# Altium project Pedalboard.PrjPCB
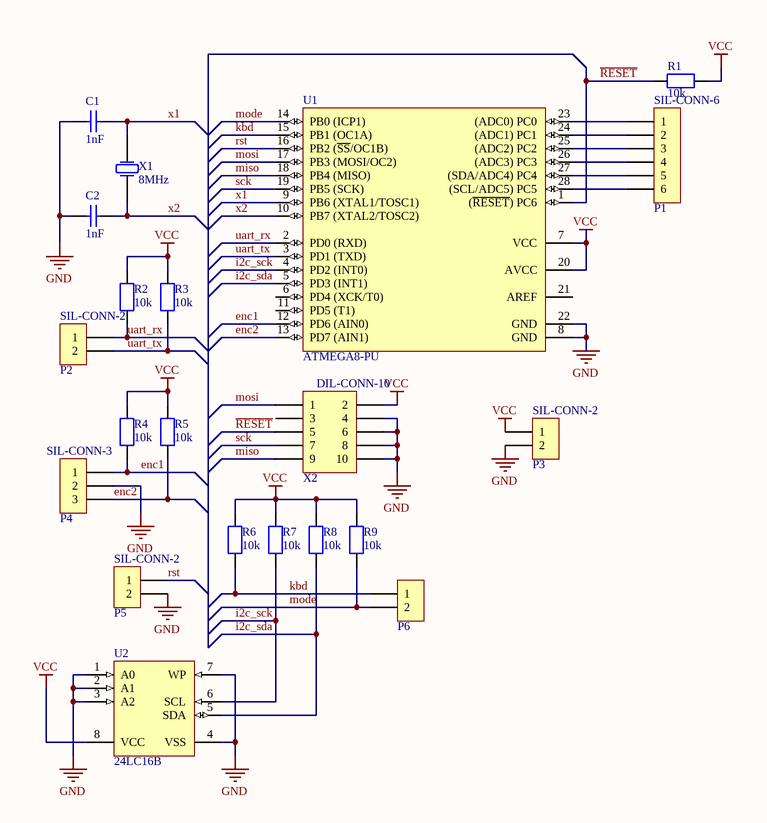
[diagram p0: AVR_MAIN.SchDoc]
5 sheets, 127 parts. Net scope: global (net labels, ports and power ports of the same name join across sheets).
Board files: AVR_MAIN.PcbDoc, AVR_KBD.PcbDoc, MOSFET_Switch_Serial.PcbDoc, MOSFET_Switch_Parallel.PcbDoc, 12-digit-display.PcbDoc
Sheets:
  AVR_MAIN.SchDoc
  AVR_KBD.SchDoc
  12-digit-display.SchDoc
  MOSFET_Switch_Serial.SchDoc
  MOSFET_Switch_Parallel.SchDoc

## Sheet AVR_MAIN.SchDoc
size A4

### Parts
C1  value 1nF  [0805_Capacitor]  (hidden comment: Capacitor)
C2  value 1nF  [0805_Capacitor]  (hidden comment: Capacitor)
P1  SIL-CONN-6  [SIL-CONN-6]
P2  SIL-CONN-2  [SIL-CONN-2]
P3  SIL-CONN-2  [SIL-CONN-2]
P4  SIL-CONN-3  [SIL-CONN-3]
P5  SIL-CONN-2  [SIL-CONN-2-jumper]
P6  SIL-CONN-2  [SIL-CONN-2]  (value not drawn)
R1  value 10k  [0805_Resistor]  (hidden comment: Resistor)
R2  value 10k  [0805_Resistor]  (hidden comment: Resistor)
R3  value 10k  [0805_Resistor]  (hidden comment: Resistor)
R4  value 10k  [0805_Resistor]  (hidden comment: Resistor)
R5  value 10k  [0805_Resistor]  (hidden comment: Resistor)
R6  value 10k  [0805_Resistor]  (hidden comment: Resistor)
R7  value 10k  [0805_Resistor]  (hidden comment: Resistor)
R8  value 10k  [0805_Resistor]  (hidden comment: Resistor)
R9  value 10k  [0805_Resistor]  (hidden comment: Resistor)
U1  ATMEGA8-PU  [DIP28_Narrow]
U2  24LC16B  [DIP8]
X1  Frequency: 8MHz  [HC49]  (hidden comment: Crystal)
X2  DIL-CONN-10  [DIL-CONN-IDC-10]

### Nets
GND: C1.1 C2.1 P3.2 P4.2 P5.2 U1.8(GND) U1.22(GND) U2.1(A0) U2.2(A1) U2.3(A2) U2.4(VSS) U2.7(WP) X2.4 X2.6 X2.8 X2.10  [project net ~{OE}]
VCC: P3.1 R1.2 R2.2 R3.2 R4.2 R5.2 R6.2 R7.2 R8.2 R9.2 U1.7(VCC) U1.20(AVCC) U2.8(VCC) X2.2
enc1: P4.1 R4.1 U1.12(PD6_(AIN0))
enc2: P4.3 R5.1 U1.13(PD7_(AIN1))
i2c_sck: R7.1 U1.4(PD2_(INT0)) U2.6(SCL)
i2c_sda: R8.1 U1.5(PD3_(INT1)) U2.5(SDA)
kbd: P6.1 R6.1 U1.15(PB1_(OC1A)) U1.18(PB4_(MISO)) X2.9  [also labelled miso]
mode: P6.2 R9.1 U1.14(PB0_(ICP1))
mosi: P2.2 R3.1 U1.3(PD1_(TXD)) U1.17(PB3_(MOSI/OC2)) X2.1  [also labelled uart_tx]
~{RESET}: R1.1 U1.1((~{RESET})_PC6) X2.5
rst: P5.1 U1.16(PB2_(~{SS}/OC1B))
sck: U1.19(PB5_(SCK)) X2.7
uart_rx: P2.1 R2.1 U1.2(PD0_(RXD))
x1: C1.2 U1.9(PB6_(XTAL1/TOSC1)) X1.2
x2: C2.2 U1.10(PB7_(XTAL2/TOSC2)) X1.1
NetP1_1: P1.1 U1.23((ADC0)_PC0)
NetP1_2: P1.2 U1.24((ADC1)_PC1)
NetP1_3: P1.3 U1.25((ADC2)_PC2)
NetP1_4: P1.4 U1.26((ADC3)_PC3)
NetP1_5: P1.5 U1.27((SDA/ADC4)_PC4)
NetP1_6: P1.6 U1.28((SCL/ADC5)_PC5)

Not connected (* = marked no-connect by the designer): U1 6(PD4_(XCK/T0)) 11(PD5_(T1)) 21(AREF); X2 3

## Sheet AVR_KBD.SchDoc
size A4
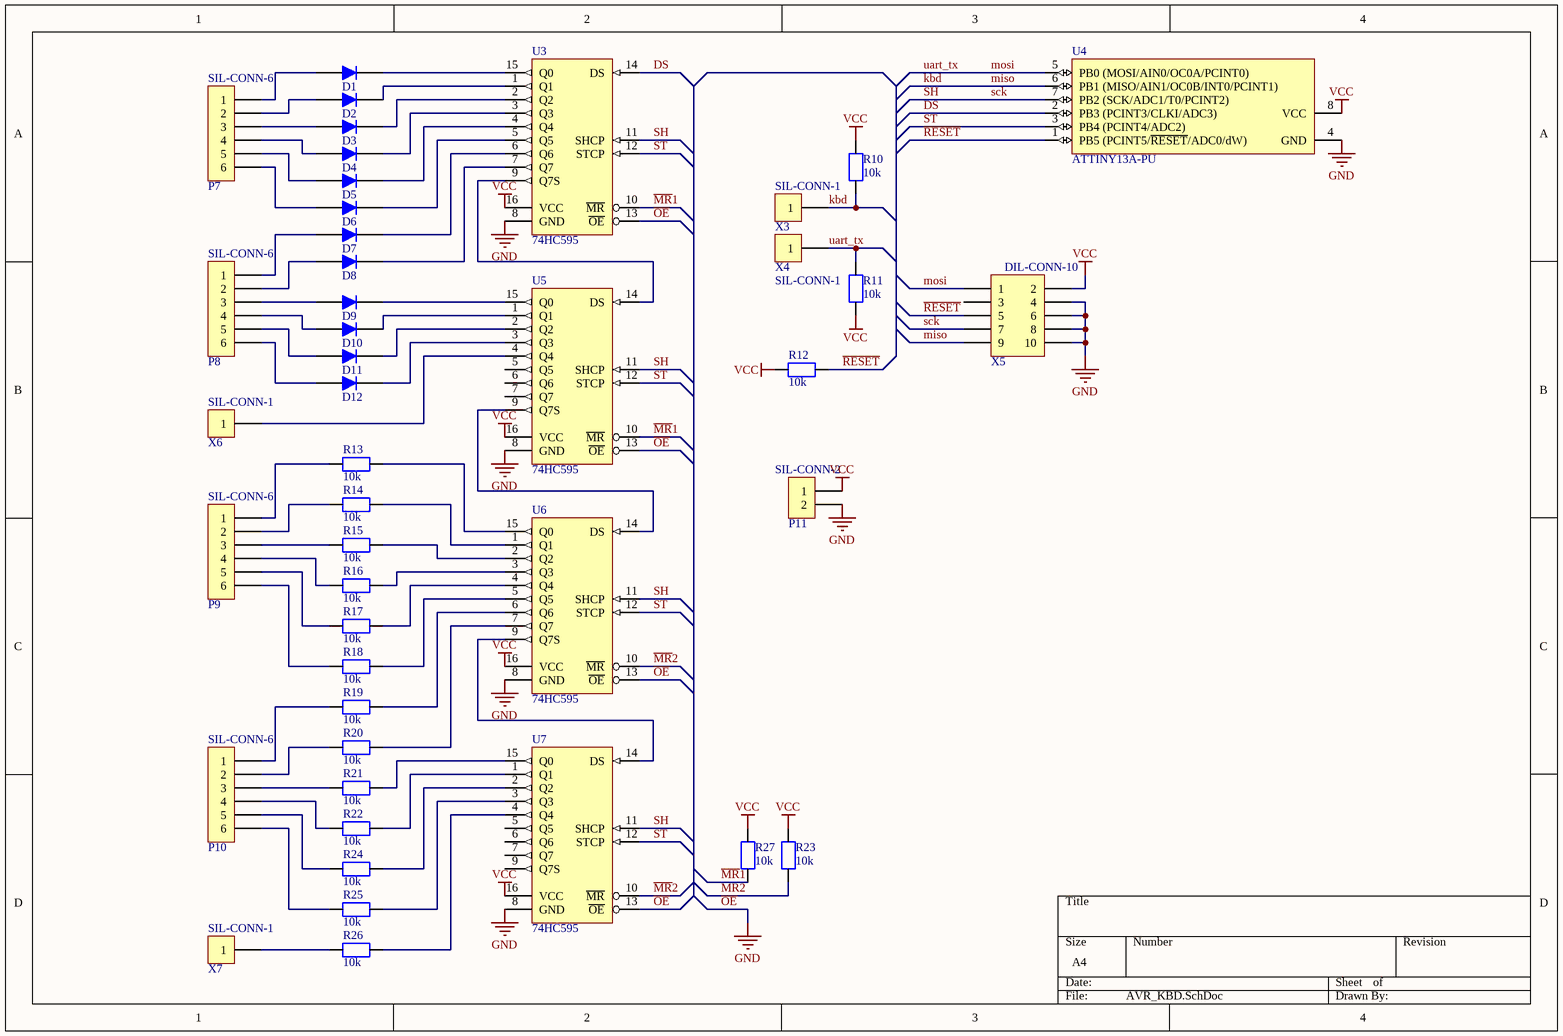
[diagram p1: AVR_KBD.SchDoc]

### Parts
D1  Diode  [DO35]  (value not drawn)
D2  Diode  [DO35]  (value not drawn)
D3  Diode  [DO35]  (value not drawn)
D4  Diode  [DO35]  (value not drawn)
D5  Diode  [DO35]  (value not drawn)
D6  Diode  [DO35]  (value not drawn)
D7  Diode  [DO35]  (value not drawn)
D8  Diode  [DO35]  (value not drawn)
D9  Diode  [DO35]  (value not drawn)
D10  Diode  [DO35]  (value not drawn)
D11  Diode  [DO35]  (value not drawn)
D12  Diode  [DO35]  (value not drawn)
P7  SIL-CONN-6  [SIL-CONN-6]
P8  SIL-CONN-6  [SIL-CONN-6]
P9  SIL-CONN-6  [SIL-CONN-6]
P10  SIL-CONN-6  [SIL-CONN-6]
P11  SIL-CONN-2  [SIL-CONN-2]
R10  value 10k  [0805_Resistor]  (hidden comment: Resistor)
R11  value 10k  [0805_Resistor]  (hidden comment: Resistor)
R12  value 10k  [0805_Resistor]  (hidden comment: Resistor)
R13  value 10k  [0805_Resistor]  (hidden comment: Resistor)
R14  value 10k  [0805_Resistor]  (hidden comment: Resistor)
R15  value 10k  [0805_Resistor]  (hidden comment: Resistor)
R16  value 10k  [0805_Resistor]  (hidden comment: Resistor)
R17  value 10k  [0805_Resistor]  (hidden comment: Resistor)
R18  value 10k  [0805_Resistor]  (hidden comment: Resistor)
R19  value 10k  [0805_Resistor]  (hidden comment: Resistor)
R20  value 10k  [0805_Resistor]  (hidden comment: Resistor)
R21  value 10k  [0805_Resistor]  (hidden comment: Resistor)
R22  value 10k  [0805_Resistor]  (hidden comment: Resistor)
R23  value 10k  [0805_Resistor]  (hidden comment: Resistor)
R24  value 10k  [0805_Resistor]  (hidden comment: Resistor)
R25  value 10k  [0805_Resistor]  (hidden comment: Resistor)
R26  value 10k  [0805_Resistor]  (hidden comment: Resistor)
R27  value 10k  [0805_Resistor]  (hidden comment: Resistor)
U3  74HC595  [SOIC16]
U4  ATTINY13A-PU  [DIP8]
U5  74HC595  [SOIC16]
U6  74HC595  [SOIC16]
U7  74HC595  [SOIC16]
X3  SIL-CONN-1  [SIL-CONN-1]
X4  SIL-CONN-1  [SIL-CONN-1]
X5  DIL-CONN-10  [DIL-CONN-IDC-10]
X6  SIL-CONN-1  [SIL-CONN-1]
X7  SIL-CONN-1  [SIL-CONN-1]

### Nets
~{OE}: P11.2 U3.8(GND) U3.13(~{OE}) U4.4(GND) U5.8(GND) U5.13(~{OE}) U6.8(GND) U6.13(~{OE}) U7.8(GND) U7.13(~{OE}) X5.4 X5.6 X5.8 X5.10  [also labelled GND]
VCC: P11.1 R10.2 R11.1 R12.2 R23.2 R27.2 U3.16(VCC) U4.8(VCC) U5.16(VCC) U6.16(VCC) U7.16(VCC) X5.2
DS: U3.14(DS) U4.2(PB3_(PCINT3/CLKI/ADC3))
kbd: R10.1 U4.6(PB1_(MISO/AIN1/OC0B/INT0/PCINT1)) X3.1 X5.9  [also labelled miso]
~{MR}1: R27.1 U3.10(~{MR}) U5.10(~{MR})
~{MR}2: R23.1 U6.10(~{MR}) U7.10(~{MR})
mosi: R11.2 U4.5(PB0_(MOSI/AIN0/OC0A/PCINT0)) X4.1 X5.1  [also labelled uart_tx]
~{RESET}: R12.1 U4.1(PB5_(PCINT5/~{RESET}/ADC0/dW)) X5.5
sck: U3.11(SHCP) U4.7(PB2_(SCK/ADC1/T0/PCINT2)) U5.11(SHCP) U6.11(SHCP) U7.11(SHCP) X5.7  [also labelled SH]
ST: U3.12(STCP) U4.3(PB4_(PCINT4/ADC2)) U5.12(STCP) U6.12(STCP) U7.12(STCP)
NetD1_A: D1.A P7.1
NetD1_K: D1.K U3.15(Q0)
NetD2_A: D2.A P7.2
NetD2_K: D2.K U3.1(Q1)
NetD3_A: D3.A P7.3
NetD3_K: D3.K U3.2(Q2)
NetD4_A: D4.A P7.4
NetD4_K: D4.K U3.3(Q3)
NetD5_A: D5.A P7.5
NetD5_K: D5.K U3.4(Q4)
NetD6_A: D6.A P7.6
NetD6_K: D6.K U3.5(Q5)
NetD7_A: D7.A P8.1
NetD7_K: D7.K U3.6(Q6)
NetD8_A: D8.A P8.2
NetD8_K: D8.K U3.7(Q7)
NetD9_A: D9.A P8.3
NetD9_K: D9.K U5.15(Q0)
NetD10_A: D10.A P8.4
NetD10_K: D10.K U5.1(Q1)
NetD11_A: D11.A P8.5
NetD11_K: D11.K U5.2(Q2)
NetD12_A: D12.A P8.6
NetD12_K: D12.K U5.3(Q3)
NetP9_1: P9.1 R13.1
NetP9_2: P9.2 R14.1
NetP9_3: P9.3 R15.1
NetP9_4: P9.4 R16.1
NetP9_5: P9.5 R17.1
NetP9_6: P9.6 R18.1
NetP10_1: P10.1 R19.1
NetP10_2: P10.2 R20.1
NetP10_3: P10.3 R21.1
NetP10_4: P10.4 R22.1
NetP10_5: P10.5 R24.1
NetP10_6: P10.6 R25.1
NetR13_2: R13.2 U6.15(Q0)
NetR14_2: R14.2 U6.1(Q1)
NetR15_2: R15.2 U6.2(Q2)
NetR16_2: R16.2 U6.3(Q3)
NetR17_2: R17.2 U6.4(Q4)
NetR18_2: R18.2 U6.5(Q5)
NetR19_2: R19.2 U6.6(Q6)
NetR20_2: R20.2 U6.7(Q7)
NetR21_2: R21.2 U7.15(Q0)
NetR22_2: R22.2 U7.1(Q1)
NetR24_2: R24.2 U7.2(Q2)
NetR25_2: R25.2 U7.3(Q3)
NetR26_1: R26.1 X7.1
NetR26_2: R26.2 U7.4(Q4)
NetU3_9: U3.9(Q7S) U5.14(DS)
NetU5_4: U5.4(Q4) X6.1
NetU5_9: U5.9(Q7S) U6.14(DS)
NetU6_9: U6.9(Q7S) U7.14(DS)

Not connected (* = marked no-connect by the designer): U5 5(Q5) 6(Q6) 7(Q7); U7 5(Q5) 6(Q6) 7(Q7) 9(Q7S); X5 3

## Sheet 12-digit-display.SchDoc
size A4
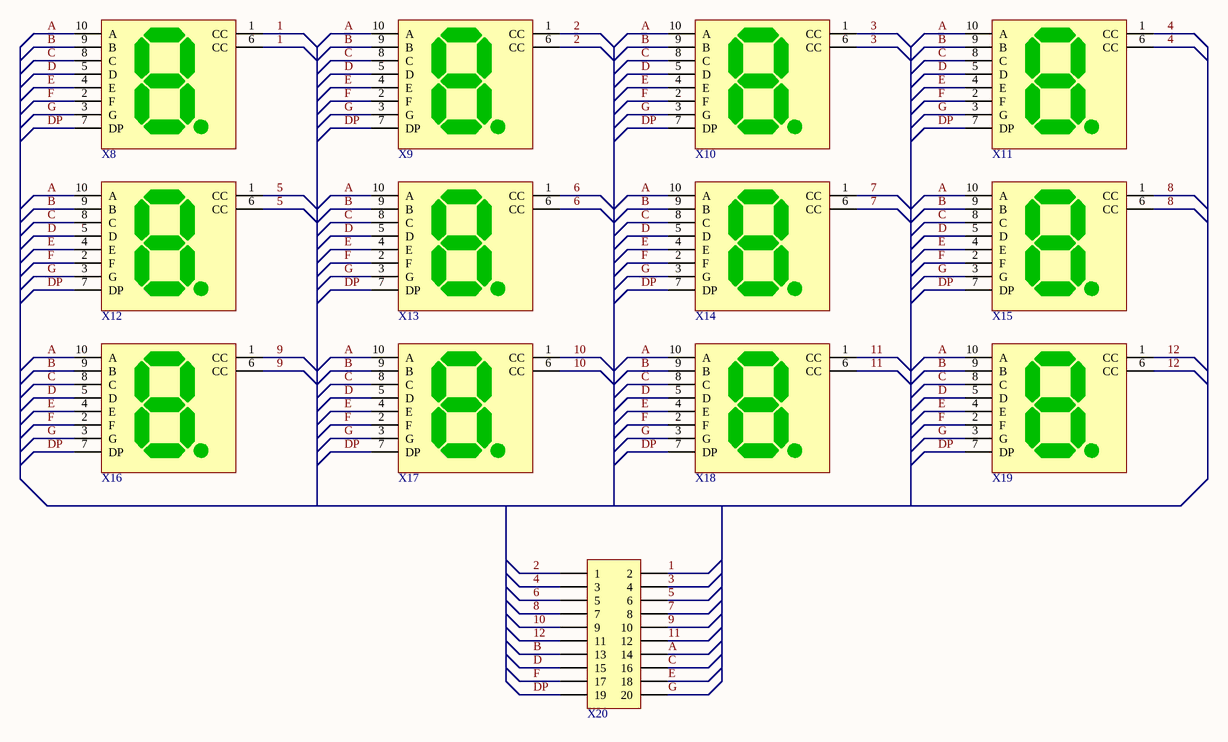
[diagram p2: 12-digit-display.SchDoc]

### Parts
X8  FYS-3912  [FYS-3916]  (value not drawn)
X9  FYS-3912  [FYS-3916]  (value not drawn)
X10  FYS-3912  [FYS-3916]  (value not drawn)
X11  FYS-3912  [FYS-3916]  (value not drawn)
X12  FYS-3912  [FYS-3916]  (value not drawn)
X13  FYS-3912  [FYS-3916]  (value not drawn)
X14  FYS-3912  [FYS-3916]  (value not drawn)
X15  FYS-3912  [FYS-3916]  (value not drawn)
X16  FYS-3912  [FYS-3916]  (value not drawn)
X17  FYS-3912  [FYS-3916]  (value not drawn)
X18  FYS-3912  [FYS-3916]  (value not drawn)
X19  FYS-3912  [FYS-3916]  (value not drawn)
X20  DIL-CONN-20  [DIL-CONN-IDC-20R]  (value not drawn)

### Nets
1: X8.1(CC) X8.6(CC) X20.2
2: X9.1(CC) X9.6(CC) X20.1
3: X10.1(CC) X10.6(CC) X20.4
4: X11.1(CC) X11.6(CC) X20.3
5: X12.1(CC) X12.6(CC) X20.6
6: X13.1(CC) X13.6(CC) X20.5
7: X14.1(CC) X14.6(CC) X20.8
8: X15.1(CC) X15.6(CC) X20.7
9: X16.1(CC) X16.6(CC) X20.10
10: X17.1(CC) X17.6(CC) X20.9
11: X18.1(CC) X18.6(CC) X20.12
12: X19.1(CC) X19.6(CC) X20.11
A: X8.10(A) X9.10(A) X10.10(A) X11.10(A) X12.10(A) X13.10(A) X14.10(A) X15.10(A) X16.10(A) X17.10(A) X18.10(A) X19.10(A) X20.14
B: X8.9(B) X9.9(B) X10.9(B) X11.9(B) X12.9(B) X13.9(B) X14.9(B) X15.9(B) X16.9(B) X17.9(B) X18.9(B) X19.9(B) X20.13
C: X8.8(C) X9.8(C) X10.8(C) X11.8(C) X12.8(C) X13.8(C) X14.8(C) X15.8(C) X16.8(C) X17.8(C) X18.8(C) X19.8(C) X20.16
D: X8.5(D) X9.5(D) X10.5(D) X11.5(D) X12.5(D) X13.5(D) X14.5(D) X15.5(D) X16.5(D) X17.5(D) X18.5(D) X19.5(D) X20.15
DP: X8.7(DP) X9.7(DP) X10.7(DP) X11.7(DP) X12.7(DP) X13.7(DP) X14.7(DP) X15.7(DP) X16.7(DP) X17.7(DP) X18.7(DP) X19.7(DP) X20.19
E: X8.4(E) X9.4(E) X10.4(E) X11.4(E) X12.4(E) X13.4(E) X14.4(E) X15.4(E) X16.4(E) X17.4(E) X18.4(E) X19.4(E) X20.18
F: X8.2(F) X9.2(F) X10.2(F) X11.2(F) X12.2(F) X13.2(F) X14.2(F) X15.2(F) X16.2(F) X17.2(F) X18.2(F) X19.2(F) X20.17
G: X8.3(G) X9.3(G) X10.3(G) X11.3(G) X12.3(G) X13.3(G) X14.3(G) X15.3(G) X16.3(G) X17.3(G) X18.3(G) X19.3(G) X20.20

## Sheet MOSFET_Switch_Serial.SchDoc
size A4
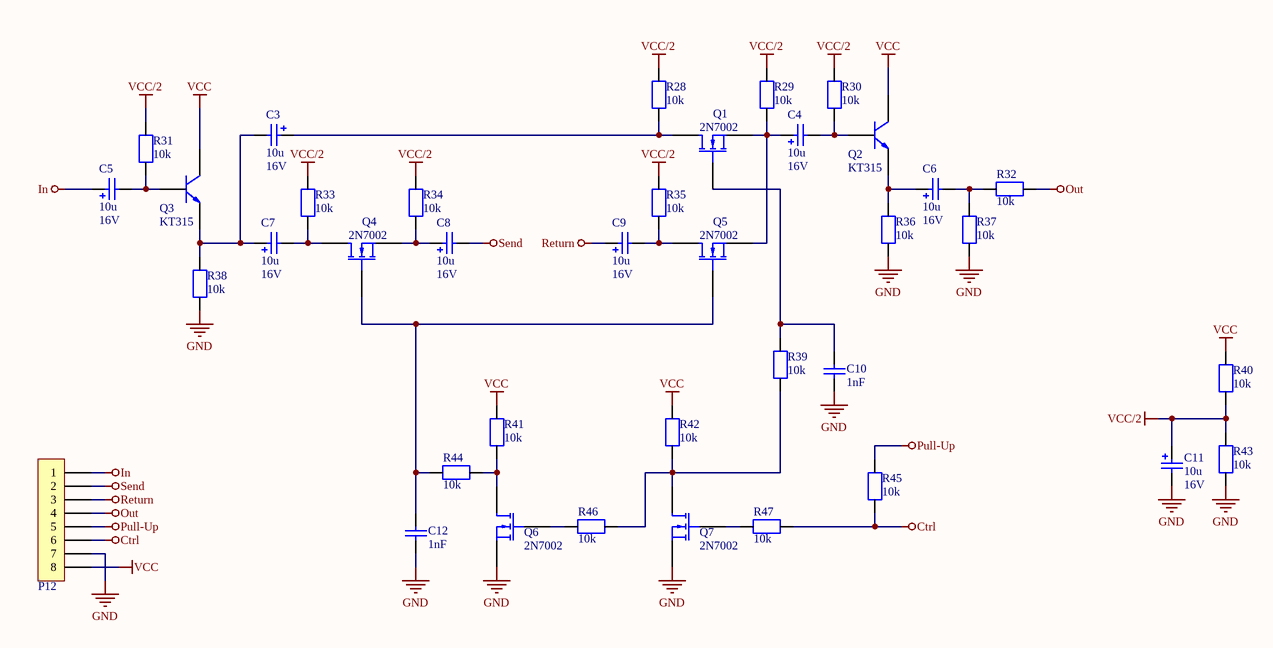
[diagram p3: MOSFET_Switch_Serial.SchDoc]

### Parts
C3  value 10u  Initial Voltage: 16V  [ELEC_RAD10]  (hidden comment: Electrolytic Capacitor)
C4  value 10u  Initial Voltage: 16V  [ELEC_RAD10]  (hidden comment: Electrolytic Capacitor)
C5  value 10u  Initial Voltage: 16V  [ELEC_RAD10]  (hidden comment: Electrolytic Capacitor)
C6  value 10u  Initial Voltage: 16V  [ELEC_RAD10]  (hidden comment: Electrolytic Capacitor)
C7  value 10u  Initial Voltage: 16V  [ELEC_RAD10]  (hidden comment: Electrolytic Capacitor)
C8  value 10u  Initial Voltage: 16V  [ELEC_RAD10]  (hidden comment: Electrolytic Capacitor)
C9  value 10u  Initial Voltage: 16V  [ELEC_RAD10]  (hidden comment: Electrolytic Capacitor)
C10  value 1nF  [0805_Capacitor]  (hidden comment: Capacitor)
C11  value 10u  Initial Voltage: 16V  [ELEC_RAD10]  (hidden comment: Electrolytic Capacitor)
C12  value 1nF  [0805_Capacitor]  (hidden comment: Capacitor)
P12  SIL-CONN-8  [SIL-CONN-8-R1]  (value not drawn)
Q1  2N7002  [SOT23-3]
Q2  KT315  [KT315]
Q3  KT315  [KT315]
Q4  2N7002  [SOT23-3]
Q5  2N7002  [SOT23-3]
Q6  2N7002  [SOT23-3]
Q7  2N7002  [SOT23-3]
R28  value 10k  [0805_Resistor]  (hidden comment: Resistor)
R29  value 10k  [0805_Resistor]  (hidden comment: Resistor)
R30  value 10k  [0805_Resistor]  (hidden comment: Resistor)
R31  value 10k  [0805_Resistor]  (hidden comment: Resistor)
R32  value 10k  [0805_Resistor]  (hidden comment: Resistor)
R33  value 10k  [0805_Resistor]  (hidden comment: Resistor)
R34  value 10k  [0805_Resistor]  (hidden comment: Resistor)
R35  value 10k  [0805_Resistor]  (hidden comment: Resistor)
R36  value 10k  [0805_Resistor]  (hidden comment: Resistor)
R37  value 10k  [0805_Resistor]  (hidden comment: Resistor)
R38  value 10k  [0805_Resistor]  (hidden comment: Resistor)
R39  value 10k  [0805_Resistor]  (hidden comment: Resistor)
R40  value 10k  [0805_Resistor]  (hidden comment: Resistor)
R41  value 10k  [0805_Resistor]  (hidden comment: Resistor)
R42  value 10k  [0805_Resistor]  (hidden comment: Resistor)
R43  value 10k  [0805_Resistor]  (hidden comment: Resistor)
R44  value 10k  [0805_Resistor]  (hidden comment: Resistor)
R45  value 10k  [0805_Resistor]  (hidden comment: Resistor)
R46  value 10k  [0805_Resistor]  (hidden comment: Resistor)
R47  value 10k  [0805_Resistor]  (hidden comment: Resistor)

### Nets
Ctrl: P12.6 R45.1 R47.1
GND: C10.1 C11.- C12.1 P12.7 Q6.S Q7.S R36.1 R37.1 R38.1 R43.1  [project net ~{OE}]
In: C5.+ P12.1
Out: P12.4 R32.1
Pull-Up: P12.5 R45.2
Return: C9.+ P12.3
Send: C8.- P12.2
VCC: P12.8 Q2.K Q3.K R40.2 R41.1 R42.1
VCC/2: C11.+ R28.2 R29.2 R30.2 R31.2 R33.2 R34.2 R35.2 R40.1 R43.2
NetC3_+: C3.+ Q1.D R28.1
NetC3_-: C3.- C7.+ Q3.E R38.2
NetC4_+: C4.+ Q1.S Q5.S R29.1
NetC4_-: C4.- Q2.B R30.1
NetC5_-: C5.- Q3.B R31.1
NetC6_+: C6.+ Q2.E R36.2
NetC6_-: C6.- R32.2 R37.2
NetC7_-: C7.- Q4.D R33.1
NetC8_+: C8.+ Q4.S R34.1
NetC9_-: C9.- Q5.D R35.1
NetC10_2: C10.2 Q1.G R39.2
NetC12_2: C12.2 Q4.G Q5.G R44.1
NetQ6_D: Q6.D R41.2 R44.2
NetQ6_G: Q6.G R46.1
NetQ7_D: Q7.D R39.1 R42.2 R46.2
NetQ7_G: Q7.G R47.2

### Library data of the parts
Q1 Q4-Q7 = 2N7002: pin to pad: D>1 G>2 S>3
Q2 Q3 = KT315: pin to pad: B>3 E>1 K>2

## Sheet MOSFET_Switch_Parallel.SchDoc
size A4
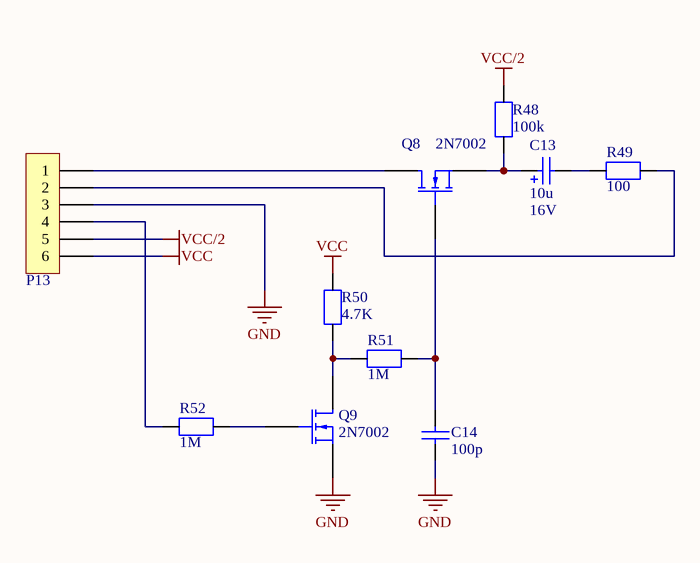
[diagram p4: MOSFET_Switch_Parallel.SchDoc]

### Parts
C13  value 10u  Initial Voltage: 16V  [ELEC_RAD10]  (hidden comment: Electrolytic Capacitor)
C14  value 100p  [0805_Capacitor]  (hidden comment: Capacitor)
P13  SIL-CONN-6  [SIL-CONN-6-R2]  (value not drawn)
Q8  2N7002  [SOT23-3]
Q9  2N7002  [SOT23-3]
R48  value 100k  [0805_Resistor]  (hidden comment: Resistor)
R49  value 100  [0805_Resistor]  (hidden comment: Resistor)
R50  value 4.7K  [0805_Resistor]  (hidden comment: Resistor)
R51  value 1M  [0805_Resistor]  (hidden comment: Resistor)
R52  value 1M  [0805_Resistor]  (hidden comment: Resistor)

### Nets
GND: C14.1 P13.3 Q9.S  [project net ~{OE}]
VCC: P13.6 R50.2
VCC/2: P13.5 R48.2
NetC13_+: C13.+ Q8.S R48.1
NetC13_-: C13.- R49.1
NetC14_2: C14.2 Q8.G R51.2
NetP13_1: P13.1 Q8.D
NetP13_2: P13.2 R49.2
NetP13_4: P13.4 R52.2
NetQ9_D: Q9.D R50.1 R51.1
NetQ9_G: Q9.G R52.1

### Library data of the parts
Q8 Q9 = 2N7002: pin to pad: D>1 G>2 S>3

## Nets that join several sheets
~{OE}: AVR_MAIN (16 pins), AVR_KBD (14 pins), MOSFET_Switch_Serial (10 pins), MOSFET_Switch_Parallel (C14.1 P13.3 Q9.S)
VCC: AVR_MAIN (14 pins), AVR_KBD (12 pins), MOSFET_Switch_Serial (6 pins), MOSFET_Switch_Parallel (P13.6 R50.2)
VCC/2: MOSFET_Switch_Serial (10 pins), MOSFET_Switch_Parallel (P13.5 R48.2)
kbd: AVR_MAIN (5 pins), AVR_KBD (R10.1 U4.6 X3.1 X5.9)
mosi: AVR_MAIN (5 pins), AVR_KBD (R11.2 U4.5 X4.1 X5.1)
~{RESET}: AVR_MAIN (R1.1 U1.1 X2.5), AVR_KBD (R12.1 U4.1 X5.5)
sck: AVR_MAIN (U1.19 X2.7), AVR_KBD (6 pins)